# EAGLE design ir_board (EAGLE 9.6.2)
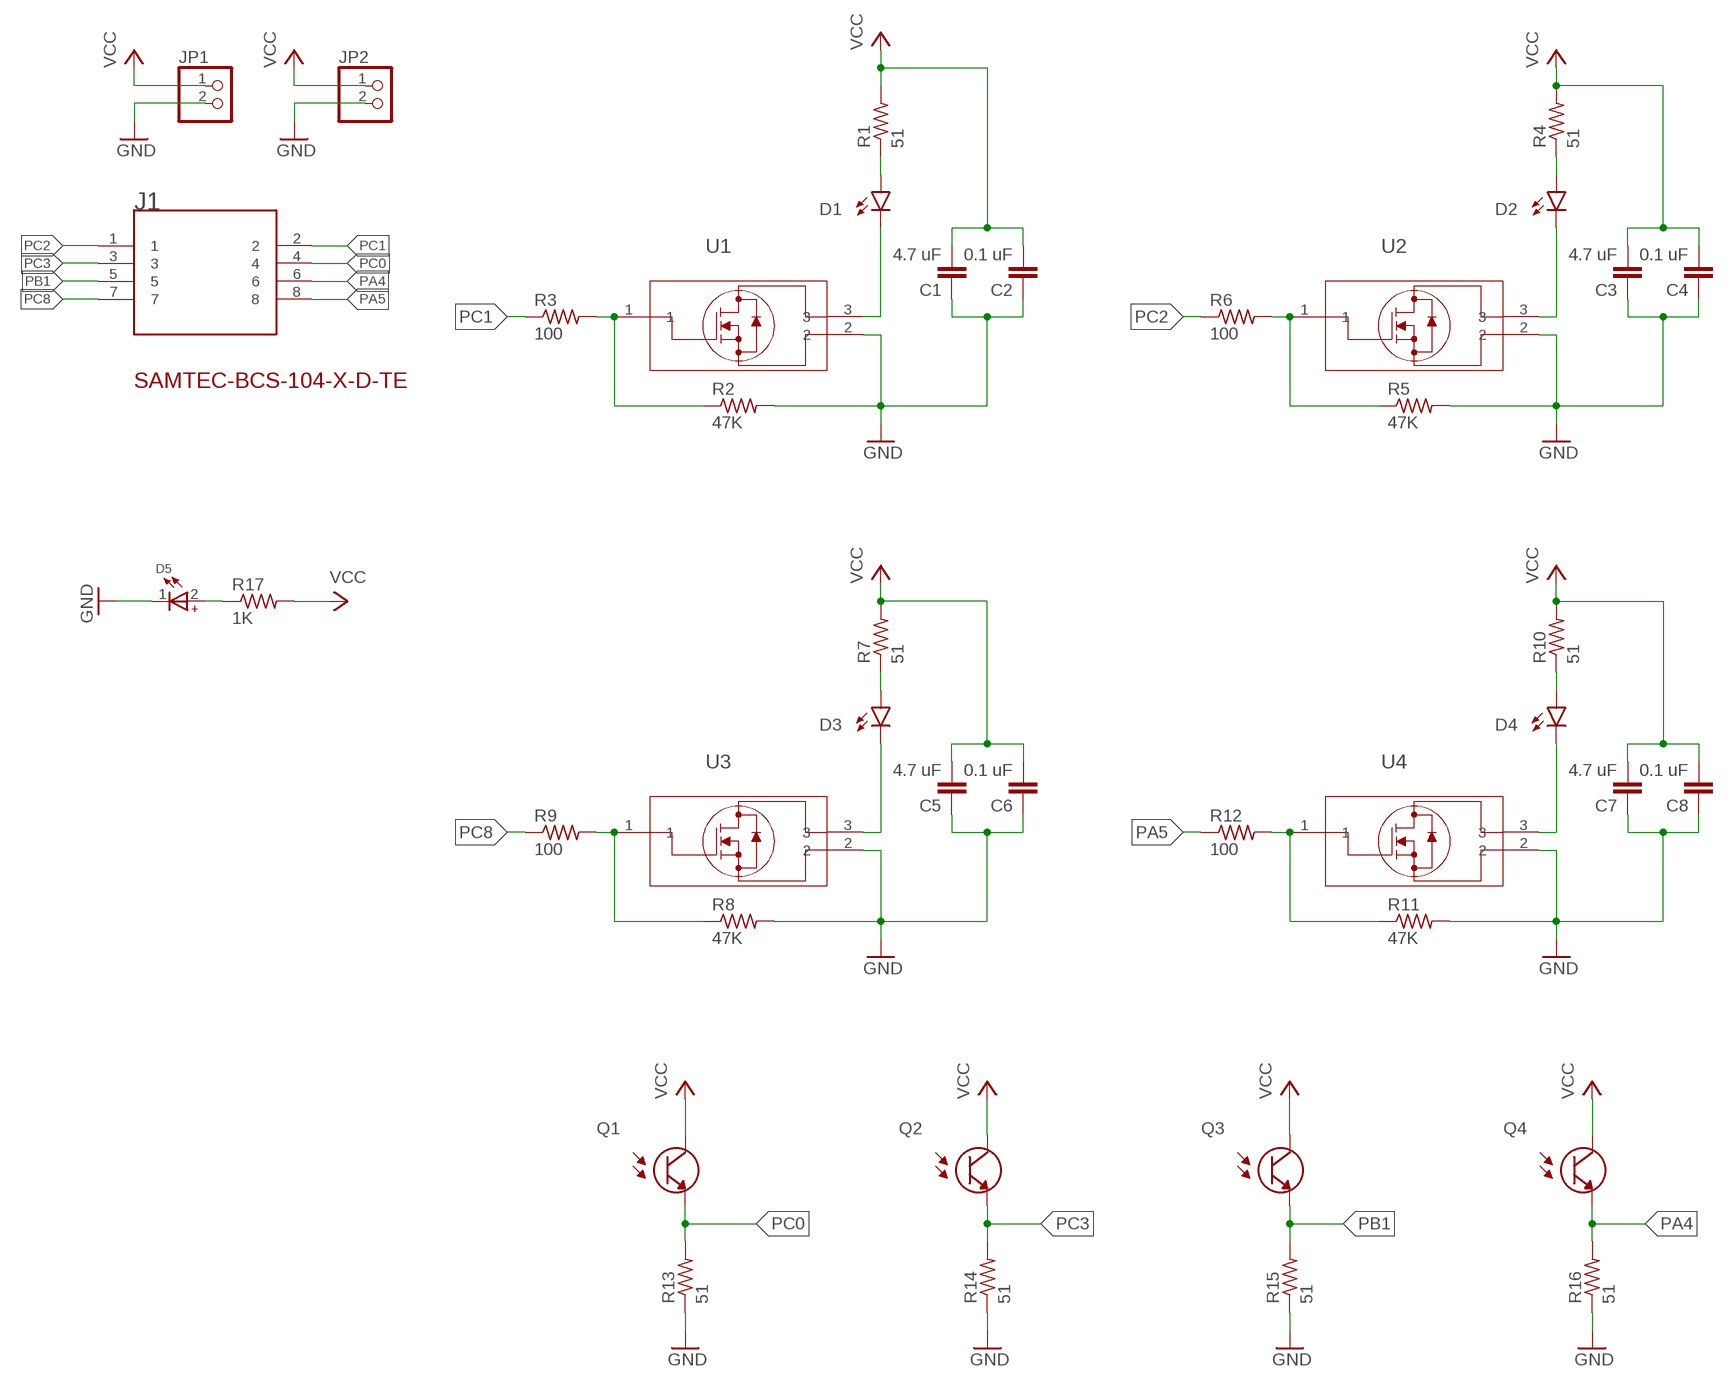
[diagram p0: schematic, sheet 1]

## Parts
C1  4.7 uF  C-EUC0805  [C0805]
C2  0.1 uF  C-EUC0805  [C0805]
C3  4.7 uF  C-EUC0805  [C0805]
C4  0.1 uF  C-EUC0805  [C0805]
C5  4.7 uF  C-EUC0805  [C0805]
C6  0.1 uF  C-EUC0805  [C0805]
C7  4.7 uF  C-EUC0805  [C0805]
C8  0.1 uF  C-EUC0805  [C0805]
D1  LED5MM  [LED5MM]
D2  LED5MM  [LED5MM]
D3  LED5MM  [LED5MM]
D4  LED5MM  [LED5MM]
D5  WL-SMCW_0805_150080BS75000  [WL-SMCW_0805]
J1  SAMTEC-BCS-104-X-D-TEJ  [SAMTEC-BCS-104-X-D-TE]
JP1  PINHD-1X2  [1X02]
JP2  PINHD-1X2  [1X02]
Q1  SFH_313_FA-3/4  [XDCR_SFH_313_FA-3/4]
Q2  SFH_313_FA-3/4  [XDCR_SFH_313_FA-3/4]
Q3  SFH_313_FA-3/4  [XDCR_SFH_313_FA-3/4]
Q4  SFH_313_FA-3/4  [XDCR_SFH_313_FA-3/4]
R1  51  R-US_R0805  [R0805]
R2  47K  R-US_R0805  [R0805]
R3  100  R-US_R0805  [R0805]
R4  51  R-US_R0805  [R0805]
R5  47K  R-US_R0805  [R0805]
R6  100  R-US_R0805  [R0805]
R7  51  R-US_R0805  [R0805]
R8  47K  R-US_R0805  [R0805]
R9  100  R-US_R0805  [R0805]
R10  51  R-US_R0805  [R0805]
R11  47K  R-US_R0805  [R0805]
R12  100  R-US_R0805  [R0805]
R13  51  R-US_R0805  [R0805]
R14  51  R-US_R0805  [R0805]
R15  51  R-US_R0805  [R0805]
R16  51  R-US_R0805  [R0805]
R17  1K  R-US_R0805  [R0805]
U1  2N7002LT1G  [SOT-23_3L_ONS]
U2  2N7002LT1G  [SOT-23_3L_ONS]
U3  2N7002LT1G  [SOT-23_3L_ONS]
U4  2N7002LT1G  [SOT-23_3L_ONS]

## Nets
GND: C1.1 C2.1 C3.1 C4.1 C5.1 C6.1 C7.1 C8.1 D5.1(-) JP1.2 JP2.2 R2.2 R5.2 R8.2 R11.2 R13.1 R14.1 R15.1 R16.1 U1.2 U2.2 U3.2 U4.2
N$1: R2.1 R3.2 U1.1
N$2: D1.K(C) U1.3
N$3: D5.2(+) R17.1
N$4: D2.A R4.1
N$5: D2.K(C) U2.3
N$6: R8.1 R9.2 U3.1
N$7: D3.A R7.1
N$8: R5.1 R6.2 U2.1
N$9: R11.1 R12.2 U4.1
N$10: D4.K(C) U4.3
N$11: D3.K(C) U3.3
N$12: D4.A R10.1
N$15: D1.A R1.1
PA4: J1.6 Q4.1(E) R16.2
PA5: J1.8 R12.1
PB1: J1.5 Q3.1(E) R15.2
PC0: J1.4 Q1.1(E) R13.2
PC1: J1.2 R3.1
PC2: J1.1 R6.1
PC3: J1.3 Q2.1(E) R14.2
PC8: J1.7 R9.1
VCC: C1.2 C2.2 C3.2 C4.2 C5.2 C6.2 C7.2 C8.2 JP1.1 JP2.1 Q1.2(C) Q2.2(C) Q3.2(C) Q4.2(C) R1.2 R4.2 R7.2 R10.2 R17.2

## Library data of the parts
C1-C8 = rcl:C-EU: CAPACITOR, European symbol; SPICEPREFIX: C
D1-D4 = led:LED: LED OSRAM: - CHIPLED LG R971, LG N971, LY N971, LG Q971, LY Q971, LO R971, LY R971 LH N974, LH R974 LS Q976, LO Q976, LY Q976 LO Q996 - Hyper CHIPLED LW Q18S LB Q993, LB Q99A, LB R99A - SideLED LS A670, LO A670, LY A670, LG A670, LP A670 LB A673, LV A673, LT A673, LW A673 LH A674 LY A675 LS A676, LA A676, LO A676, LY A676, LW A676 LS A679, LY A679, LG A679 - Hyper Micro SIDELED® LS Y876, LA Y876, LO Y876, LY Y876 LT Y87S - SmartLED LW L88C, LW L88S LB L89C, LB L89S, LG L890 LS L89K, LO L89K, LY L89K LS L896, LA L896, LO L896, LY L896 - TOPLED LS T670, LO T670, LY T670, LG T670, LP T670 LSG T670, LSP T670, LSY T670, LOP T670, LYG T670 LG T671, LOG T671, LSG T671 LB T673, LV T673, LT T673, LW T673 LH T674 LS T676, LA T676, LO T676, LY T676, LB T676, LH T676, LSB T676, LW T676 LB T67C, LV T67C, LT T67C, LS T67K, LO T67K, LY T67K, LW E67C LS E67B, LA E67B, LO E67B, LY E67B, LB E67C, LV E67C, LT E67C LW T67C LS T679, LY T679, LG T679 LS T770, LO T770, LY T770, LG T770, LP T770 LB T773, LV T773, LT T773, LW T773 LH T774 LS E675, LA E675, LY E675, LS T675 LS T776, LA T776, LO T776, LY T776, LB T776 LHGB T686 LT T68C, LB T68C - Hyper Mini TOPLED® LB M676 - Mini TOPLED Santana® LG M470 LS M47K, LO M47K, LY M47K Source: http://www.osram.convergy.de LUXEON: - LUMILED® LXK2-PW12-R00, LXK2-PW12-S00, LXK2-PW14-U00, LXK2-PW14-V00 LXK2-PM12-R00, LXK2-PM12-S00, LXK2-PM14-U00 LXK2-PE12-Q00, LXK2-PE12-R00, LXK2-PE12-S00, LXK2-PE14-T00, LXK2-PE14-U00 LXK2-PB12-K00, LXK2-PB12-L00, LXK2-PB12-M00, LXK2-PB14-N00, LXK2-PB14-P00, LXK2-PB14-Q00 LXK2-PR12-L00, LXK2-PR12-M00, LXK2-PR14-Q00, LXK2-PR14-R00 LXK2-PD12-Q00, LXK2-PD12-R00, LXK2-PD12-S00 LXK2-PH12-R00, LXK2-PH12-S00 LXK2-PL12-P00, LXK2-PL12-Q00, LXK2-PL12-R00 Source: www.luxeon.com KINGBRIGHT: KA-3528ASYC Source: www.kingbright.com
D5 = Wurth_LEDs_WL-SMCW:WL-SMCW_0805: WL-SMCW SMT Mono-color Chip LED Waterclea Characteristics Low energy consumption High reliability Low current requirement Fast switching No UV/IR radiation Smallest SMD LED package for exceptional brightness Top view LED Wide viewing angle Better solder ability Heat dissipation Applications Backlight for mobile and portable device keypads Indoor and outdoor message boards Flat backlight for LCDs, switches and symbols Display for industrial control systems and traffic Miniaturized color effects Pedestrian mark Optical indicators Tabular backlight: LCD, telephone key-press, power-switch, display board Indoor displays Signals Identifiers Backlight for automobile DVD LED General lighting Toys <https://www.we-online.com/catalog/media/o14904v209%20Family_WL-SMCW.jpg> Details see: https://www.we-online.com/catalog/en/WL-SMCW/ Updated BY Yingchun,Shan 2020-03-18 2020(C) Wurth Elektronik; ABSTRAHLWINKEL: 140°; CHIP-TECHNOLOGY: InGaN; DATASHEET-URL: https://www.we-online.com/catalog/datasheet/150080BS75000.pdf; EMITTING-COLOR: Blue; I-V-TYP: 145mcd; LAMDA-DOM-TYP: 470nm; LAMDA-PEAK-TYP: 465nm; PART-NUMBER: 150080BS75000; V-F-TYP: 3.2V
J1 = SAMTEC-BCS-104-X-D-TE:SAMTEC-BCS-104-X-D-TE: Check prices <https://pricing.snapeda.com/parts/BCS-104-LM-D-TE/Samtec/view-part?ref=eda>; AVAILABILITY: Bad; DESCRIPTION: 8 Position Receptacle Connector 0.100 (2.54mm) Through Hole Gold; MF: Samtec; MP: BCS-104-LM-D-TE; PACKAGE: None; PRICE: None; PURCHASE-URL: https://pricing.snapeda.com/search/part/BCS-104-LM-D-TE/?ref=eda
JP1 JP2 = pinhead:PINHD-1X2: PIN HEADER
Q1-Q4 = SFH_313_FA-3_4:SFH_313_FA-3/4: Phototransistor IR Chip Silicon 870nm 2-Pin T-1 3/4; AVAILABILITY: Unavailable; DESCRIPTION: Phototransistors 870nm Top View Radial - 2 Leads; MF: OSRAM Opto; MP: SFH 313 FA-3/4; PACKAGE: Radial-2 Osram Opto; PRICE: None
R1-R17 = rcl:R-US_: RESISTOR, American symbol; SPICEPREFIX: R
U1-U4 = MOSFET_2N7002LT1G:2N7002LT1G; BUILT_BY: EMA_Justin; COPYRIGHT: Copyright (C) 2018 Accelerated Designs. All rights reserved; DATASHEET: https://www.onsemi.com/pub/Collateral/2N7002L-D.PDF; MANUFACTURER_PART_NUMBER: 2N7002LT1G; SOURCELIBRARY: ON_Semiconductor_2020-01-13; VENDOR: ON Semiconductor

## Board
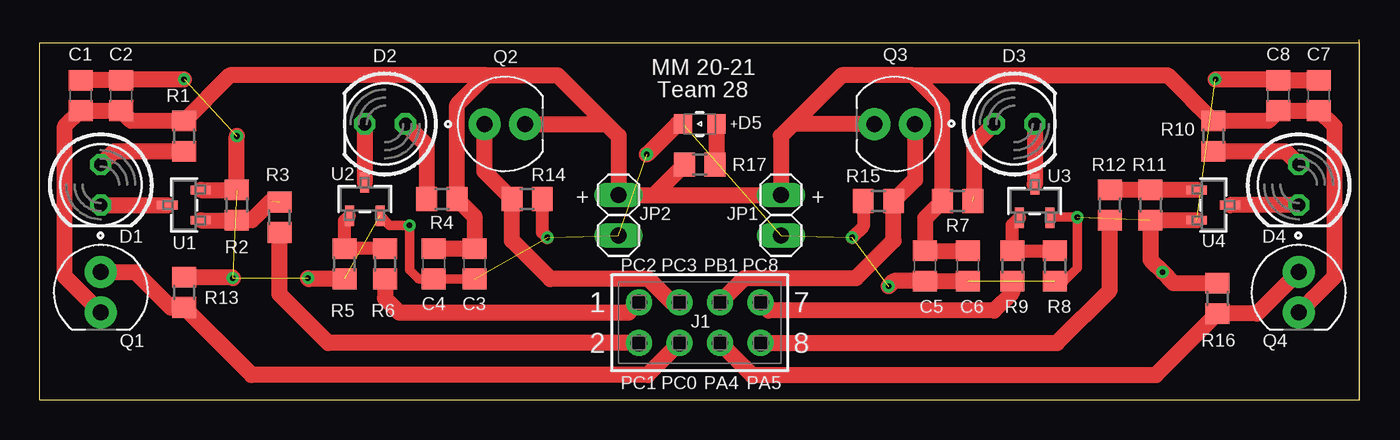
[diagram p1: board, top side]
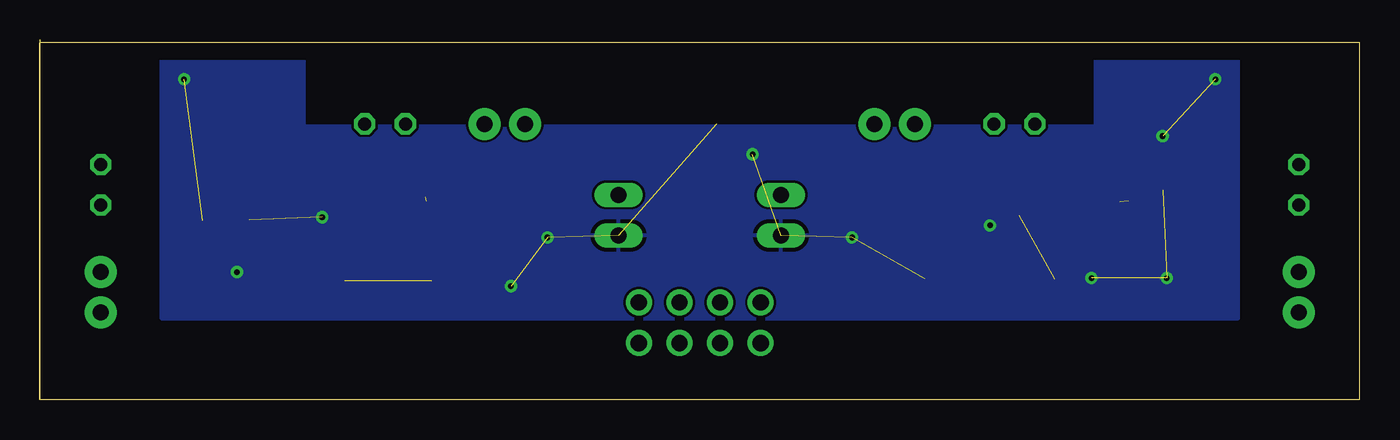
[diagram p2: board, bottom side, seen from below]

Size 82.55 x 22.53 mm. Coordinates in mm from the lower left corner, seen from the top.
Outline: 82.53,0 82.53,22.53
Outline: 0,0 82.55,0 82.55,22.35 0,22.35 0,0
Copper layers (1*16): Top 0.035mm / dielectric 1.5mm / Bottom 0.035mm
Design rules "default": minimum track width 6mil, minimum drill 0.35mm, track to track 6mil, track to pad 6mil, pad to pad 6mil, via to via 6mil, smd to smd 6mil, copper to edge 40mil, drill to drill 6mil, minimum pad ring 10mil, minimum via ring 8mil, stop-mask expansion 4mil, vias tented up to drill 0mil, thermal gap 10mil

### Footprints (pad centres in the part's own frame; a part is rotated, then mirrored left to right if it is on the bottom)
C0805 = smd 1.3 x 1.5: 1 -0.95,0; 2 0.95,0
LED5MM = drill 0.813 octagon: A -1.27,0; K 1.27,0
WL-SMCW_0805 = smd 1.1 x 1.2: 1 -1.05,0; 2 1.05,0
SAMTEC-BCS-104-X-D-TE = drill 1.02 pad 1.62: 1 -3.81,1.27; 2 -3.81,-1.27; 3 -1.27,1.27; 4 -1.27,-1.27; 5 1.27,1.27; 6 1.27,-1.27; 7 3.81,1.27; 8 3.81,-1.27
1X02 = drill 1.016 long: 1 -1.27,0; 2 1.27,0
XDCR_SFH_313_FA-3/4 = drill 1 pad 2: 1 -1.27,0; 2 1.27,0
R0805 = smd 1.3 x 1.5: 1 -0.95,0; 2 0.95,0
SOT-23_3L_ONS = smd 0.559 x 1.27: 1 -0.953,-1.041; 2 0.953,-1.041; 3 0,1.041

### Placement (x,y rotation side)
C1  2.54,19.05 270 top
C2  5.08,19.05 270 top
C3  27.18,8.51 90 top
C4  24.64,8.51 90 top
C5  55.37,8.38 90 top
C6  58.04,8.38 90 top
C7  80.01,19.05 270 top
C8  77.47,19.05 270 top
D1  3.81,13.46 270 top
D2  21.59,17.27 180 top
D3  60.96,17.27 0 top
D4  78.74,13.46 270 top
D5  41.27,17.27 0 top
J1  41.27,4.83 0 top
JP1  46.35,11.56 270 top
JP2  36.2,11.56 270 top
Q1  3.81,6.73 270 top
Q2  29.08,17.27 0 top
Q3  53.47,17.27 180 top
Q4  78.74,6.73 270 top
R1  9.02,16.51 90 top
R2  12.32,12.19 90 top
R3  14.99,11.43 90 top
R4  25.15,12.57 0 top
R5  19.05,8.51 270 top
R6  21.59,8.51 90 top
R7  57.4,12.45 180 top
R8  63.5,8.38 270 top
R9  60.83,8.38 90 top
R10  73.41,16.51 90 top
R11  69.47,12.19 270 top
R12  66.93,12.19 90 top
R13  9.02,6.73 270 top
R14  30.48,12.57 180 top
R15  52.45,12.45 0 top
R16  73.66,6.35 270 top
R17  41.27,14.73 180 top
U1  9.02,12.19 90 top
U2  20.32,12.57 0 top
U3  62.23,12.45 0 top
U4  73.41,12.19 270 top

### Tracks (layer width: path | path; a pad name or v marks a point on that pad's centre or on a via)
GND  (via drill 0.35)  (13 unrouted)
  Top 0.61: U2.2 21.88,10.92 v23.11,10.92 23.11,8.13 23.68,7.56 C4.1 C3.1 | U3.2 63.21,11.43 v64.9,11.43 64.9,8.26 64.07,7.43 R8.2
  Top 0.813: R15.1 51.5,10.86 v50.8,10.16 | v31.75,10.16 31.43,10.48 R14.1
  Top 1.016: C7.1 C8.1 77.4,20.07 v73.53,20.07 | C6.1 C5.1 53.41,7.43 v53.09,7.11 | U1.2 R2.2 v12.32,16.51 | C1.1 C2.1 5.15,20.07 v9.02,20.07 | U4.2 R11.2 69.47,8.76 v70.23,8 70.93,7.3 R16.1 73.6,7.24 | R13.1 12,7.68 v12.06,7.62 | R5.2 16.82,7.56 v16.76,7.62 | D5.1 39.88,17.27 v37.97,15.37
  pour Bottom: 7.62,21.59 7.62,5.08 74.93,5.08 74.93,21.59 66.04,21.59 66.04,17.14 16.51,17.14 16.51,21.59
N$1  (1 unrouted)
  Top 1.016: U1.1 R2.1 13.27,11.24 14.48,12.45
N$2
  Top 1.016: D1.K U1.3
N$3
  Top 1.016: 42.33,14.63 R17.1 42.33,14.83 D5.2
N$4
  Top 1.016: D2.A 24.2,15.94 R4.1
N$5
  Top 1.016: D2.K U2.3
N$6
  Top 0.813: U3.1 60.83,10.96 R9.2 R8.1
N$7  (1 unrouted)
  Top 1.016: D3.A 58.42,16 58.42,12.7
N$8
  Top 0.152: 19.37,9.78 R5.1
  Top 0.813: U2.1 19.05,11.21 R5.1 R6.2
N$9
  Top 1.016: U4.1 R11.1 R12.2
N$10
  Top 1.016: D4.K U4.3
N$11
  Top 1.016: D3.K U3.3
N$12
  Top 1.016: R10.1 77.91,15.56 D4.A
N$15
  Top 1.016: D1.A 4.64,15.56 R1.1
PA4
  Top 1.016: Q4.1 76.14,5.4 R16.2 69.82,1.56 44.54,1.56 J1.6
PA5
  Top 1.016: J1.8 63.63,3.56 66.93,6.86 R12.1
PB1
  Top 1.016: Q3.1 54.74,13.78 R15.2 53.4,9.97 51.05,7.62 44.07,7.62 J1.5
PC0
  Top 1.016: Q1.1 5.97,8 8.19,5.78 R13.2 13.24,1.56 38.01,1.56 J1.4
PC1
  Top 1.016: R3.1 14.99,6.6 18.03,3.56 J1.2
PC2
  Top 1.016: R6.1 21.59,6.35 22.48,5.46 36.83,5.46 J1.1
PC3
  Top 1.016: Q2.1 27.81,14.29 R14.2 29.53,9.97 31.93,7.57 38.07,7.57 39.54,6.1 J1.3
PC8
  Top 1.016: 60.96,7.3 R9.1 60.83,6.73 59.69,5.59 45.59,5.59 J1.7
VCC
  Top 1.016: C4.2 C3.2 27.18,11.49 R4.2 26.1,18.48 27.94,20.32 | C6.2 C5.2 55.37,11.36 R7.2 56.45,18.48 54.61,20.32 | Q1.2 1.56,7.71 1.56,17.12 C1.2 C2.2 5.72,17.46 R1.2 11.88,20.32 27.94,20.32 | 54.61,20.32 50.16,20.32 47.12,17.27 | Q3.2 47.12,17.27 | 27.94,20.32 32.38,20.32 35.43,17.27 | Q2.2 35.43,17.27 | Q4.2 80.99,7.71 80.99,17.12 C7.2 C8.2 76.83,17.46 R10.2 70.55,20.32 54.61,20.32 | 35.43,17.27 36.2,16.51 JP2.1 38.42,12.83 | 47.12,17.27 46.35,16.51 JP1.1 38.42,12.83 | 38.42,12.83 R17.2

### Text on the board
tNames: MM 20-21 | Team 28 | + | + | PC2 | PC3 | PB1 | PC8 | PC1 | PC0 | PA4 | PA5